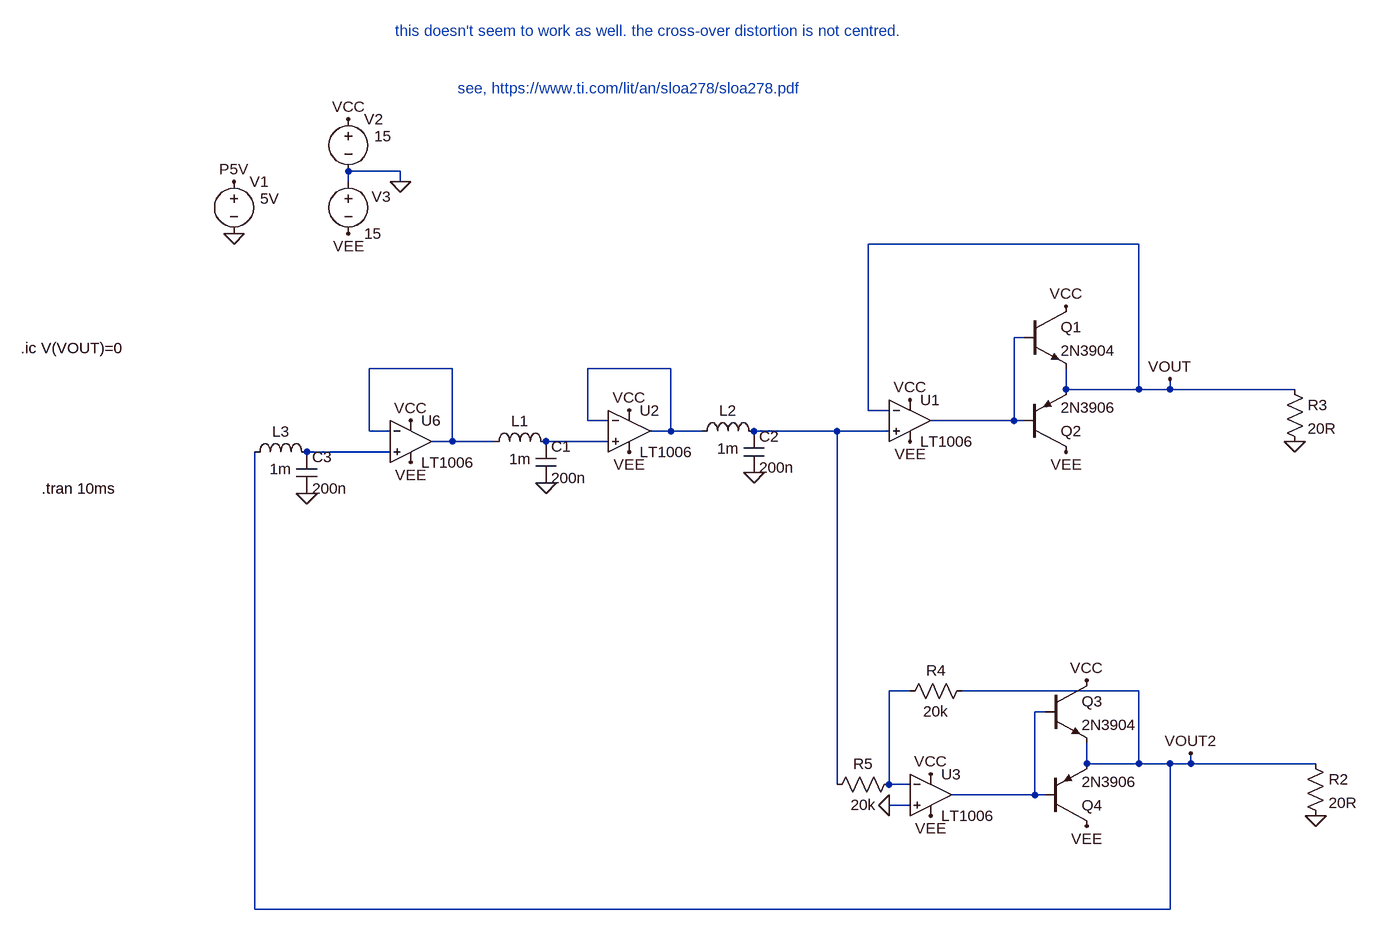
[diagram p0: schematic Draft05.asc]
Draft05.asc, the LTspice schematic file:
Version 4
SHEET 1 2720 1124
WIRE -496 -112 -576 -112
WIRE -576 -96 -576 -112
WIRE -496 -96 -496 -112
WIRE 640 0 224 0
WIRE 464 144 448 144
WIRE -416 192 -544 192
WIRE -80 192 -208 192
WIRE 528 224 528 192
WIRE 640 224 640 0
WIRE 640 224 528 224
WIRE 688 224 688 208
WIRE 688 224 640 224
WIRE 880 224 688 224
WIRE 224 256 224 0
WIRE 256 256 224 256
WIRE -208 272 -208 192
WIRE -176 272 -208 272
WIRE 448 272 448 144
WIRE 448 272 320 272
WIRE 464 272 448 272
WIRE -544 288 -544 192
WIRE -512 288 -544 288
WIRE -80 288 -80 192
WIRE -80 288 -112 288
WIRE -32 288 -80 288
WIRE 176 288 48 288
WIRE 256 288 176 288
WIRE -416 304 -416 192
WIRE -416 304 -448 304
WIRE -352 304 -416 304
WIRE -176 304 -272 304
WIRE -512 320 -640 320
WIRE 288 688 256 688
WIRE 640 688 368 688
WIRE 496 720 480 720
WIRE 560 800 560 768
WIRE 640 800 640 688
WIRE 640 800 560 800
WIRE 688 800 640 800
WIRE 720 800 720 784
WIRE 720 800 688 800
WIRE 912 800 720 800
WIRE 176 832 176 288
WIRE 256 832 256 688
WIRE 288 832 256 832
WIRE 480 848 480 720
WIRE 480 848 352 848
WIRE 496 848 480 848
WIRE 288 864 256 864
WIRE -720 1024 -720 320
WIRE 688 1024 688 800
WIRE 688 1024 -720 1024
FLAG -496 -96 0
FLAG -576 -192 VCC
FLAG -576 -16 VEE
FLAG -752 -96 P5V
FLAG -752 -16 0
FLAG -480 272 VCC
FLAG -480 336 VEE
FLAG -272 368 0
FLAG 288 240 VCC
FLAG 288 304 VEE
FLAG 688 208 VOUT
FLAG -144 256 VCC
FLAG -144 320 VEE
FLAG 48 352 0
FLAG 528 96 VCC
FLAG 528 320 VEE
FLAG 880 304 0
FLAG 320 816 VCC
FLAG 320 880 VEE
FLAG 720 784 VOUT2
FLAG 560 672 VCC
FLAG 560 896 VEE
FLAG 912 880 0
FLAG 256 864 0
FLAG -640 384 0
SYMBOL voltage -576 -208 R0
WINDOW 123 0 0 Left 0
WINDOW 39 0 0 Left 0
WINDOW 3 40 42 Left 2
SYMATTR Value 15
SYMATTR InstName V2
SYMBOL voltage -576 -112 R0
WINDOW 123 0 0 Left 0
WINDOW 39 0 0 Left 0
WINDOW 0 36 39 Left 2
SYMATTR InstName V3
SYMATTR Value 15
SYMBOL voltage -752 -112 R0
WINDOW 123 0 0 Left 0
WINDOW 39 0 0 Left 0
WINDOW 3 40 42 Left 2
SYMATTR Value 5V
SYMATTR InstName V1
SYMBOL OpAmps\\LT1006 -480 240 R0
SYMATTR InstName U6
SYMBOL cap -288 304 R0
SYMATTR InstName C1
SYMATTR Value 200n
SYMBOL OpAmps\\LT1006 288 208 R0
SYMATTR InstName U1
SYMBOL OpAmps\\LT1006 -144 224 R0
SYMATTR InstName U2
SYMBOL cap 32 288 R0
SYMATTR InstName C2
SYMATTR Value 200n
SYMBOL npn 464 96 R0
SYMATTR InstName Q1
SYMATTR Value 2N3904
SYMBOL pnp 464 320 M180
SYMATTR InstName Q2
SYMATTR Value 2N3906
SYMBOL res 864 208 R0
SYMATTR InstName R3
SYMATTR Value 20R
SYMBOL ind -368 320 R270
WINDOW 0 32 56 VTop 2
WINDOW 3 5 56 VBottom 2
SYMATTR InstName L1
SYMATTR Value 1m
SYMBOL ind -48 304 R270
WINDOW 0 32 56 VTop 2
WINDOW 3 5 56 VBottom 2
SYMATTR InstName L2
SYMATTR Value 1m
SYMBOL OpAmps\\LT1006 320 784 R0
SYMATTR InstName U3
SYMBOL npn 496 672 R0
SYMATTR InstName Q3
SYMATTR Value 2N3904
SYMBOL pnp 496 896 M180
SYMATTR InstName Q4
SYMATTR Value 2N3906
SYMBOL res 896 784 R0
SYMATTR InstName R2
SYMATTR Value 20R
SYMBOL res 384 672 R90
WINDOW 0 0 56 VBottom 2
WINDOW 3 32 56 VTop 2
SYMATTR InstName R4
SYMATTR Value 20k
SYMBOL res 160 848 R270
WINDOW 0 32 56 VTop 2
WINDOW 3 0 56 VBottom 2
SYMATTR InstName R5
SYMATTR Value 20k
SYMBOL cap -656 320 R0
SYMATTR InstName C3
SYMATTR Value 200n
SYMBOL ind -736 336 R270
WINDOW 0 32 56 VTop 2
WINDOW 3 5 56 VBottom 2
SYMATTR InstName L3
SYMATTR Value 1m
TEXT -1048 376 Left 2 !.tran 10ms
TEXT -1080 160 Left 2 !.ic V(VOUT)=0
TEXT -408 -240 Left 2 ;see, https://www.ti.com/lit/an/sloa278/sloa278.pdf
TEXT -504 -328 Left 2 ;this doesn't seem to work as well. the cross-over distortion is not centred.

The netlist it stands for:
* Draft05.asc
V2 VCC 0 15
V3 0 VEE 15
V1 P5V 0 5V
XU6 N006 N002 VCC VEE N002 LT1006  ; pins In+ In- V+ V- OUT
C1 N005 0 200n
XU1 N004 VOUT VCC VEE N001 LT1006  ; pins In+ In- V+ V- OUT
XU2 N005 N003 VCC VEE N003 LT1006  ; pins In+ In- V+ V- OUT
C2 N004 0 200n
Q1 VCC N001 VOUT 0 2N3904
Q2 VEE N001 VOUT 0 2N3906
R3 VOUT 0 20R
L1 N002 N005 1m
L2 N003 N004 1m
XU3 0 N007 VCC VEE N008 LT1006  ; pins In+ In- V+ V- OUT
Q3 VCC N008 VOUT2 0 2N3904
Q4 VEE N008 VOUT2 0 2N3906
R2 VOUT2 0 20R
R4 VOUT2 N007 20k
R5 N004 N007 20k
C3 N006 0 200n
L3 VOUT2 N006 1m
.model NPN NPN
.model PNP PNP
.lib standard.bjt
.tran 10ms
.ic V(VOUT)=0
* see, https://www.ti.com/lit/an/sloa278/sloa278.pdf
* this doesn't seem to work as well. the cross-over distortion is not centred.
.lib LTC.lib
.backanno
.end